# Altium project rc_car.PrjPcb
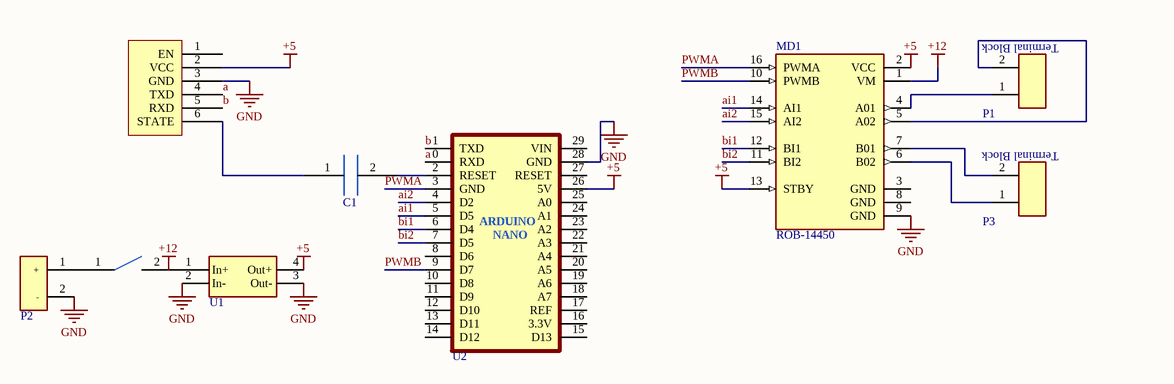
[diagram p0: rc_car.SchDoc]
1 sheet, 9 parts. Net scope: global (net labels, ports and power ports of the same name join across sheets).
Board file: rc_car.PcbDoc

## Sheet rc_car.SchDoc
size 250 x 149 mm; SheetNumber: 1; SheetTotal: 1

### Parts
(Parts that share a designator on the sheet are numbered #1, #2 ... from top to bottom, then left to right.)
?#1  hc-05 development  [hc-05 - duplicate]  (value not drawn)
?#2  Switch  [Switch]  (value not drawn)
C1  Capacitor (Ceramic)  [Capacitor (Ceramic)]  (value not drawn)
MD1  ROB-14450  [TB6612FNG]
P1  Terminal Block 2 Pin  [Terminal Block 2 Pin]  (value not drawn)
P2  HEADER, 2 PINS  [XT60 Male]  (value not drawn)
P3  Terminal Block 2 Pin  [Terminal Block 2 Pin]  (value not drawn)
U1  LM2596  [LM2596]  (value not drawn)
U2  Arduino Nano  [Arduino Nano]  (value not drawn)

### Nets
+5: ?#1.2(VCC) MD1.2(VCC) MD1.13(STBY) U1.4(Out+) U2.26(5V)
+12: MD1.1(VM)
GND: ?#1.3(GND) MD1.9(GND) P2.2(-) U1.2(In-) U1.3(Out-) U2.28(GND)
a: ?#1.4(TXD) U2.0(RXD)
ai1: MD1.14(AI1) U2.5(D5)
ai2: MD1.15(AI2) U2.4(D2)
b: ?#1.5(RXD) U2.1(TXD)
bi1: MD1.12(BI1) U2.6(D4)
bi2: MD1.11(BI2) U2.7(D5)
PWMA: MD1.16(PWMA) U2.3(GND)
PWMB: MD1.10(PWMB) U2.9(D7)
Net?#1_6: ?#1.6(STATE) C1.1
Net?#2_1: ?#2.1 P2.1(+)
Net?#2_2: ?#2.2 U1.1(In+)
NetC1_2: C1.2 U2.2(RESET)
NetMD1_4: MD1.4(A01) P1.1
NetMD1_5: MD1.5(A02) P1.2
NetMD1_6: MD1.6(B02) P3.1
NetMD1_7: MD1.7(B01) P3.2

Not connected (* = marked no-connect by the designer): ?#1 1(EN); MD1 3(GND) 8(GND); U2 8(D6) 10(D8) 11(D9) 12(D10) 13(D11) 14(D12) 15(D13) 16(3.3V) 17(REF) 18(A7) 19(A6) 20(A5) 21(A4) 22(A3) 23(A2) 24(A1) 25(A0) 27(RESET) 29(VIN)

### Notes on the sheet
- Labels drawn without touching a wire or pin: +12
- (in symbol Arduino Nano) ARDUINO; NANO
- (in symbol Terminal Block 2 Pin) Terminal Block

### Library data of the parts
?#2 = Switch: Rocker Switch
MD1 = TB6612FNG: TB6612FNG Motor Controller/Driver Power Management Evaluation Board; MF: SparkFun Electronics; Check_prices: https://www.snapeda.com/parts/ROB-14450/SparkFun%20Electronics/view-part/2656367/?ref=eda; Package: None; MP: ROB-14450; Value: *; Availability: In Stock; SnapEDA_Link: https://www.snapeda.com/parts/ROB-14450/SparkFun%20Electronics/view-part/2656367/?ref=snap; Price: None
P1 P3 = Terminal Block 2 Pin: 2 pin; MF: TE Connectivity; MP: 282837-2; SnapEDA_Link: https://www.snapeda.com/parts/282837-2/TE+Connectivity+AMP+Connectors/view-part/?ref=snap; Price: None; Check_prices: https://www.snapeda.com/parts/282837-2/TE+Connectivity+AMP+Connectors/view-part/?ref=eda; Purchase-URL: https://pricing.snapeda.com/search/part/282837-2/?ref=eda; Value: *; Availability: In Stock; Package: None
P2 = XT60 MALE: CONNECTOR
U1 = LM2596: DC-DC BUCK CONVERTER, MAX 3 AMP, OUTPUT 1.25-35 V
U2 = Arduino Nano: Development Board